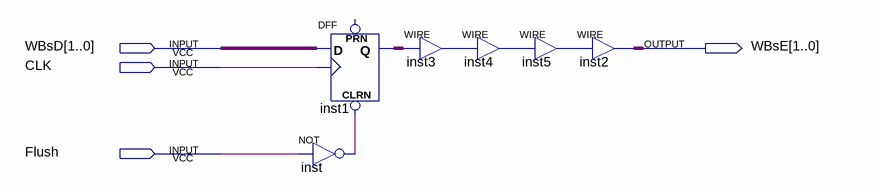
[diagram p0: schematic sheet]
// Quartus schematic ID_E_test.bdf as structural Verilog: 6 symbols, 4 pins
module ID_E_test (
  input  [1:0] WBsD,
  input  CLK,
  input  Flush,
  output [1:0] WBsE
);

  wire inst3_out, inst4_out, inst5_out, inst_out;
  wire [1:0] inst1_q;

  DFF inst1[1:0] (.CLRN(inst_out), .CLK(CLK), .D(WBsD), .Q(inst1_q));  // open: PRN
  not inst (inst_out, Flush);
  assign inst3_out = inst1_q;  // WIRE inst3
  assign inst4_out = inst3_out;  // WIRE inst4
  assign inst5_out = inst4_out;  // WIRE inst5
  assign WBsE = {2{inst5_out}};  // WIRE inst2
endmodule
